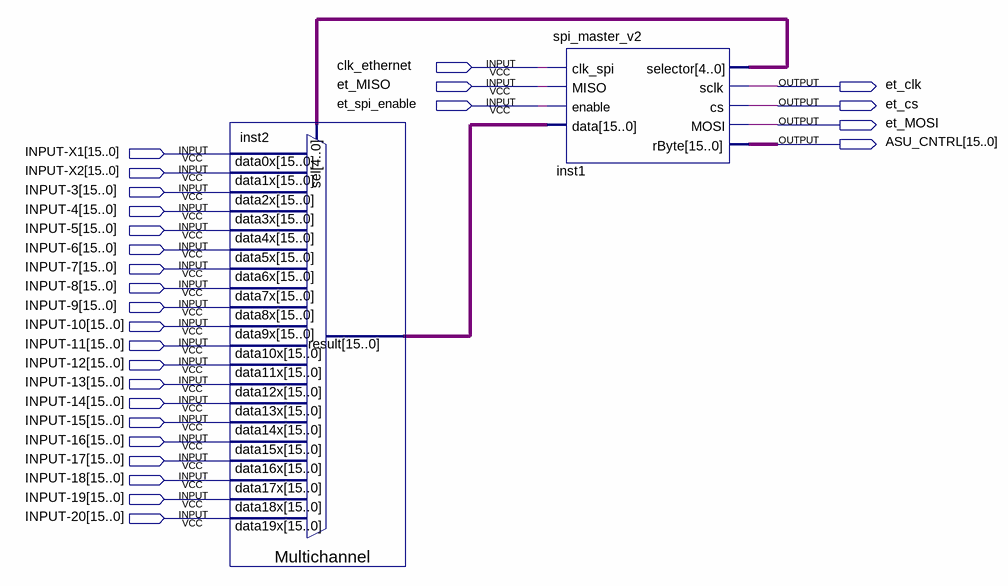
[diagram p0: schematic sheet]
// Quartus schematic SB-ethernet.bdf as structural Verilog: 2 symbols, 27 pins
module \SB-ethernet  (
  input  clk_ethernet,
  input  et_MISO,
  input  et_spi_enable,
  input  [15:0] \INPUT-X1 ,
  input  [15:0] \INPUT-X2 ,
  input  [15:0] \INPUT-3 ,
  input  [15:0] \INPUT-4 ,
  input  [15:0] \INPUT-5 ,
  input  [15:0] \INPUT-6 ,
  input  [15:0] \INPUT-7 ,
  input  [15:0] \INPUT-8 ,
  input  [15:0] \INPUT-9 ,
  input  [15:0] \INPUT-10 ,
  input  [15:0] \INPUT-11 ,
  input  [15:0] \INPUT-12 ,
  input  [15:0] \INPUT-13 ,
  input  [15:0] \INPUT-14 ,
  input  [15:0] \INPUT-15 ,
  input  [15:0] \INPUT-16 ,
  input  [15:0] \INPUT-17 ,
  input  [15:0] \INPUT-18 ,
  input  [15:0] \INPUT-19 ,
  input  [15:0] \INPUT-20 ,
  output et_clk,
  output et_cs,
  output et_MOSI,
  output [15:0] ASU_CNTRL
);

  wire [4:0] inst1_selector;
  wire [15:0] inst2_result;

  Multichannel inst2 (
    .data19x(\INPUT-20 ), .data18x(\INPUT-19 ), .data17x(\INPUT-18 ), .data16x(\INPUT-17 ),
    .data15x(\INPUT-16 ), .data14x(\INPUT-15 ), .data13x(\INPUT-14 ), .data12x(\INPUT-13 ),
    .data11x(\INPUT-12 ), .data10x(\INPUT-11 ), .data9x(\INPUT-10 ), .data8x(\INPUT-9 ), .data7x(\INPUT-8 ),
    .data6x(\INPUT-7 ), .data5x(\INPUT-6 ), .data4x(\INPUT-5 ), .data3x(\INPUT-4 ), .data2x(\INPUT-3 ),
    .data1x(\INPUT-X2 ), .data0x(\INPUT-X1 ), .sel(inst1_selector), .result(inst2_result));
  spi_master_v2 inst1 (
    .clk_spi(clk_ethernet), .MISO(et_MISO), .enable(et_spi_enable), .data(inst2_result),
    .selector(inst1_selector), .sclk(et_clk), .cs(et_cs), .MOSI(et_MOSI), .rByte(ASU_CNTRL));
endmodule
